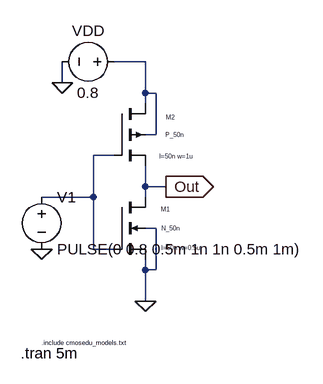
[diagram p0: schematic Inverter UPT.asc]
Inverter UPT.asc, the LTspice schematic file:
Version 4
SHEET 1 880 680
WIRE 176 -32 128 -32
WIRE 48 0 48 -32
WIRE 176 16 176 -32
WIRE 192 16 176 16
WIRE 176 32 176 16
WIRE 192 80 192 16
WIRE 192 80 176 80
WIRE 128 112 96 112
WIRE 176 160 176 128
WIRE 208 160 176 160
WIRE 96 176 96 112
WIRE 96 176 16 176
WIRE 176 176 176 160
WIRE 192 224 176 224
WIRE 96 256 96 176
WIRE 128 256 96 256
WIRE 176 288 176 272
WIRE 192 288 192 224
WIRE 192 288 176 288
WIRE 176 336 176 288
FLAG 208 160 Out
IOPIN 208 160 Out
FLAG 176 336 0
FLAG 48 0 0
FLAG 16 256 0
SYMBOL nmos4 128 176 R0
WINDOW 0 72 19 Left 0
WINDOW 3 73 48 Left 0
WINDOW 123 73 78 Left 0
SYMATTR InstName M1
SYMATTR Value N_50n
SYMATTR Value2 l=50n w=0.5u
SYMBOL pmos4 128 32 R0
WINDOW 0 80 21 Left 0
WINDOW 3 79 48 Left 0
WINDOW 123 70 81 Left 0
SYMATTR InstName M2
SYMATTR Value P_50n
SYMATTR Value2 l=50n w=1u
SYMBOL voltage 144 -32 R90
WINDOW 0 -32 56 VBottom 2
WINDOW 3 32 56 VTop 2
WINDOW 123 0 0 Left 0
WINDOW 39 0 0 Left 0
SYMATTR InstName VDD
SYMATTR Value 0.8
SYMBOL voltage 16 160 R0
WINDOW 123 0 0 Left 0
WINDOW 39 0 0 Left 0
SYMATTR InstName V1
SYMATTR Value PULSE(0 0.8 0.5m 1n 1n 0.5m 1m)
TEXT 16 400 Left 0 !.include cmosedu_models.txt
TEXT -16 416 Left 2 !.tran 5m

The netlist it stands for:
* Inverter UPT.asc
M1 Out N002 0 0 N_50n l=50n w=0.5u
M2 N001 N002 Out N001 P_50n l=50n w=1u
VDD N001 0 0.8
V1 N002 0 PULSE(0 0.8 0.5m 1n 1n 0.5m 1m)
.model NMOS NMOS
.model PMOS PMOS
.lib standard.mos
.include cmosedu_models.txt
.tran 5m
.backanno
.end